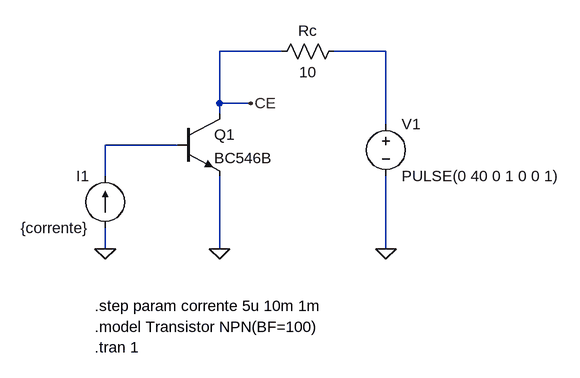
[diagram p0: schematic Tutorial_LTSpice_Ep5-CurvasBJT.asc]
Tutorial_LTSpice_Ep5-CurvasBJT.asc, the LTspice schematic file:
Version 4
SHEET 1 880 680
WIRE 272 32 176 32
WIRE 432 32 352 32
WIRE 176 112 176 32
WIRE 224 112 176 112
WIRE 176 128 176 112
WIRE 432 144 432 32
WIRE 112 176 0 176
WIRE 0 224 0 176
WIRE 0 336 0 304
WIRE 176 336 176 224
WIRE 432 336 432 224
FLAG 176 336 0
FLAG 432 336 0
FLAG 0 336 0
FLAG 224 112 CE
SYMBOL npn 112 128 R0
SYMATTR InstName Q1
SYMATTR Value BC546B
SYMBOL voltage 432 128 R0
WINDOW 123 0 0 Left 2
WINDOW 39 0 0 Left 2
SYMATTR InstName V1
SYMATTR Value PULSE(0 40 0 1 0 0 1)
SYMBOL res 368 16 R90
WINDOW 0 0 56 VBottom 2
WINDOW 3 32 56 VTop 2
SYMATTR InstName Rc
SYMATTR Value 10
SYMBOL current 0 304 R180
WINDOW 0 24 80 Left 2
WINDOW 3 24 0 Left 2
WINDOW 123 0 0 Left 2
WINDOW 39 0 0 Left 2
SYMATTR InstName I1
SYMATTR Value {corrente}
TEXT -16 488 Left 2 !.tran 1
TEXT -16 424 Left 2 !.step param corrente 5u 10m 1m
TEXT -16 456 Left 2 !.model Transistor NPN(BF=100)

The netlist it stands for:
* Tutorial_LTSpice_Ep5-CurvasBJT.asc
Q1 CE N002 0 0 BC546B
V1 N001 0 PULSE(0 40 0 1 0 0 1)
Rc N001 CE 10
I1 0 N002 {corrente}
.model NPN NPN
.model PNP PNP
.lib standard.bjt
.tran 1
.step param corrente 5u 10m 1m
.model Transistor NPN(BF=100)
.backanno
.end